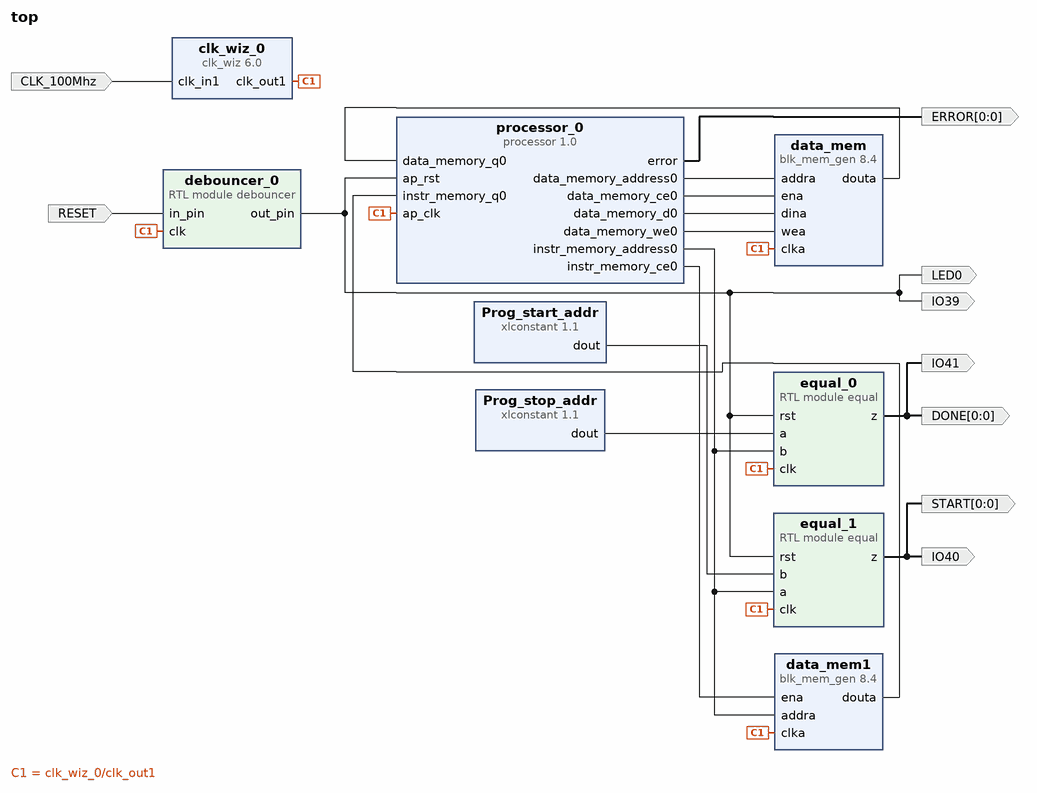
[diagram p0: block diagram of the top level]
# Vivado block design top, xc7a100tcsg324-1, Vivado 2023.1.1
create_bd_design top

create_bd_port -dir I CLK_100Mhz
create_bd_port -dir I RESET
create_bd_port -dir O -from 0 -to 0 DONE
create_bd_port -dir O -from 0 -to 0 START
create_bd_port -dir O -from 0 -to 0 ERROR
create_bd_port -dir O LED0
create_bd_port -dir O IO40
create_bd_port -dir O IO41
create_bd_port -dir O IO39

create_bd_cell -type ip -vlnv xilinx.com:ip:clk_wiz:6.0 clk_wiz_0
set_property -dict [list \
  CONFIG.CLKFB_IN_SIGNALING SINGLE \
  CONFIG.CLKOUT1_JITTER 130.958 \
  CONFIG.CLKOUT1_REQUESTED_OUT_FREQ 100 \
  CONFIG.CLKOUT2_JITTER 151.636 \
  CONFIG.CLKOUT2_PHASE_ERROR 98.575 \
  CONFIG.CLKOUT2_REQUESTED_OUT_FREQ 50 \
  CONFIG.CLKOUT2_USED false \
  CONFIG.FEEDBACK_SOURCE FDBK_AUTO \
  CONFIG.MMCM_CLKOUT0_DIVIDE_F 10.000 \
  CONFIG.MMCM_CLKOUT1_DIVIDE 1 \
  CONFIG.MMCM_COMPENSATION ZHOLD \
  CONFIG.NUM_OUT_CLKS 1 \
  CONFIG.USE_LOCKED false \
  CONFIG.USE_POWER_DOWN false \
  CONFIG.USE_RESET false \
] [get_bd_cells clk_wiz_0]
create_bd_cell -type ip -vlnv xilinx.com:ip:xlconstant:1.1 Prog_stop_addr
set_property -dict {CONFIG.CONST_VAL 0x80 CONFIG.CONST_WIDTH 32} [get_bd_cells Prog_stop_addr]
create_bd_cell -type ip -vlnv xilinx.com:ip:xlconstant:1.1 Prog_start_addr
set_property -dict {CONFIG.CONST_VAL 0x40 CONFIG.CONST_WIDTH 32} [get_bd_cells Prog_start_addr]
create_bd_cell -type module -reference equal equal_0
create_bd_cell -type module -reference equal equal_1
create_bd_cell -type module -reference debouncer debouncer_0
set_property -dict {CONFIG.MAX_COUNT 50000} [get_bd_cells debouncer_0]
create_bd_cell -type ip -vlnv xilinx.com:ip:blk_mem_gen:8.4 data_mem
set_property -dict [list \
  CONFIG.Coe_File ../../../../../../../benchmark_coe/dry2_data.coe \
  CONFIG.Fill_Remaining_Memory_Locations true \
  CONFIG.Load_Init_File true \
  CONFIG.Memory_Type Single_Port_RAM \
  CONFIG.Register_PortA_Output_of_Memory_Primitives false \
  CONFIG.Write_Depth_A 51200 \
  CONFIG.use_bram_block Stand_Alone \
] [get_bd_cells data_mem]
create_bd_cell -type ip -vlnv TJ:hls:processor:1.0 processor_0
create_bd_cell -type ip -vlnv xilinx.com:ip:blk_mem_gen:8.4 data_mem1
set_property -dict [list \
  CONFIG.Coe_File ../../../../../../../benchmark_coe/dry2_instr.coe \
  CONFIG.Fill_Remaining_Memory_Locations false \
  CONFIG.Load_Init_File true \
  CONFIG.Memory_Type Single_Port_ROM \
  CONFIG.Register_PortA_Output_of_Memory_Primitives false \
  CONFIG.Write_Depth_A 51200 \
  CONFIG.use_bram_block Stand_Alone \
] [get_bd_cells data_mem1]

# ---- connections ----

connect_bd_net [get_bd_ports CLK_100Mhz] [get_bd_pins clk_wiz_0/clk_in1]
connect_bd_net [get_bd_pins processor_0/instr_memory_address0] [get_bd_pins data_mem1/addra] [get_bd_pins equal_1/a] [get_bd_pins equal_0/b]
connect_bd_net [get_bd_ports RESET] [get_bd_pins debouncer_0/in_pin]
connect_bd_net [get_bd_pins clk_wiz_0/clk_out1] \
  [get_bd_pins equal_1/clk] [get_bd_pins equal_0/clk] [get_bd_pins debouncer_0/clk] [get_bd_pins data_mem/clka] \
  [get_bd_pins processor_0/ap_clk] [get_bd_pins data_mem1/clka]
connect_bd_net [get_bd_pins data_mem1/douta] [get_bd_pins processor_0/instr_memory_q0]
connect_bd_net [get_bd_pins data_mem/douta] [get_bd_pins processor_0/data_memory_q0]
connect_bd_net [get_bd_pins debouncer_0/out_pin] \
  [get_bd_pins equal_1/rst] [get_bd_pins equal_0/rst] [get_bd_ports LED0] [get_bd_ports IO39] \
  [get_bd_pins processor_0/ap_rst]
connect_bd_net [get_bd_pins equal_0/z] [get_bd_ports DONE] [get_bd_ports IO41]
connect_bd_net [get_bd_pins equal_1/z] [get_bd_ports START] [get_bd_ports IO40]
connect_bd_net [get_bd_pins processor_0/data_memory_address0] [get_bd_pins data_mem/addra]
connect_bd_net [get_bd_pins processor_0/data_memory_ce0] [get_bd_pins data_mem/ena]
connect_bd_net [get_bd_pins processor_0/data_memory_d0] [get_bd_pins data_mem/dina]
connect_bd_net [get_bd_pins processor_0/data_memory_we0] [get_bd_pins data_mem/wea]
connect_bd_net [get_bd_pins processor_0/error] [get_bd_ports ERROR]
connect_bd_net [get_bd_pins processor_0/instr_memory_ce0] [get_bd_pins data_mem1/ena]
connect_bd_net -net xlconstant_0_dout [get_bd_pins Prog_stop_addr/dout] [get_bd_pins equal_0/a]
connect_bd_net -net xlconstant_1_dout [get_bd_pins Prog_start_addr/dout] [get_bd_pins equal_1/b]

validate_bd_design
save_bd_design
